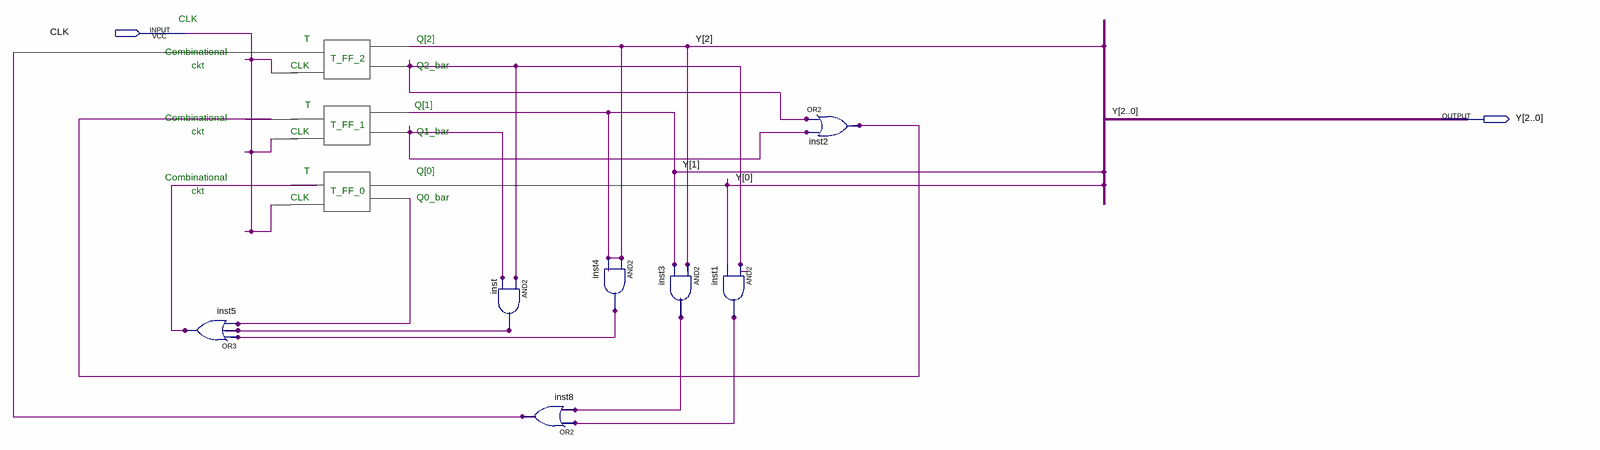
[diagram p0: schematic sheet]
// Quartus schematic seq_block_final.bdf as structural Verilog: 7 symbols, 2 pins
module seq_block_final (
  input  CLK,
  output [2:0] Y
);

  wire inst1_out, inst2_out, inst3_out, inst4_out, inst5_out, inst8_out, inst_out, undriven, undriven_2,
       undriven_3;

  or inst5 (inst5_out, inst4_out, inst_out, undriven);
  and inst (inst_out, undriven_3, undriven_2);
  or inst8 (inst8_out, inst1_out, inst3_out);
  and inst4 (inst4_out, Y[2], Y[2]);
  and inst3 (inst3_out, Y[2], Y[2]);
  and inst1 (inst1_out, undriven_3, Y[0]);
  or inst2 (inst2_out, undriven_3, undriven_2);

  assign Y[1] = Y[2];

  // Notes on the sheet:
  //   CLK
  //   T
  //   Q[2]
  //   Combinational
  //   T_FF_2
  //   ckt
  //   CLK
  //   Q2_bar
  //      T
  //     Q[1]
  //   Combinational
  //   T_FF_1
  //   ckt
  //   CLK
  //   Q1_bar
  //   T
  //   Q[0]
  //   Combinational
  //   ckt
  //   T_FF_0
  //   CLK
  //   Q0_bar
endmodule
